# Altium schematic sheet Kivipallur_joonis2.SchDoc
size A4; SheetNumber: 3; SheetTotal: 4
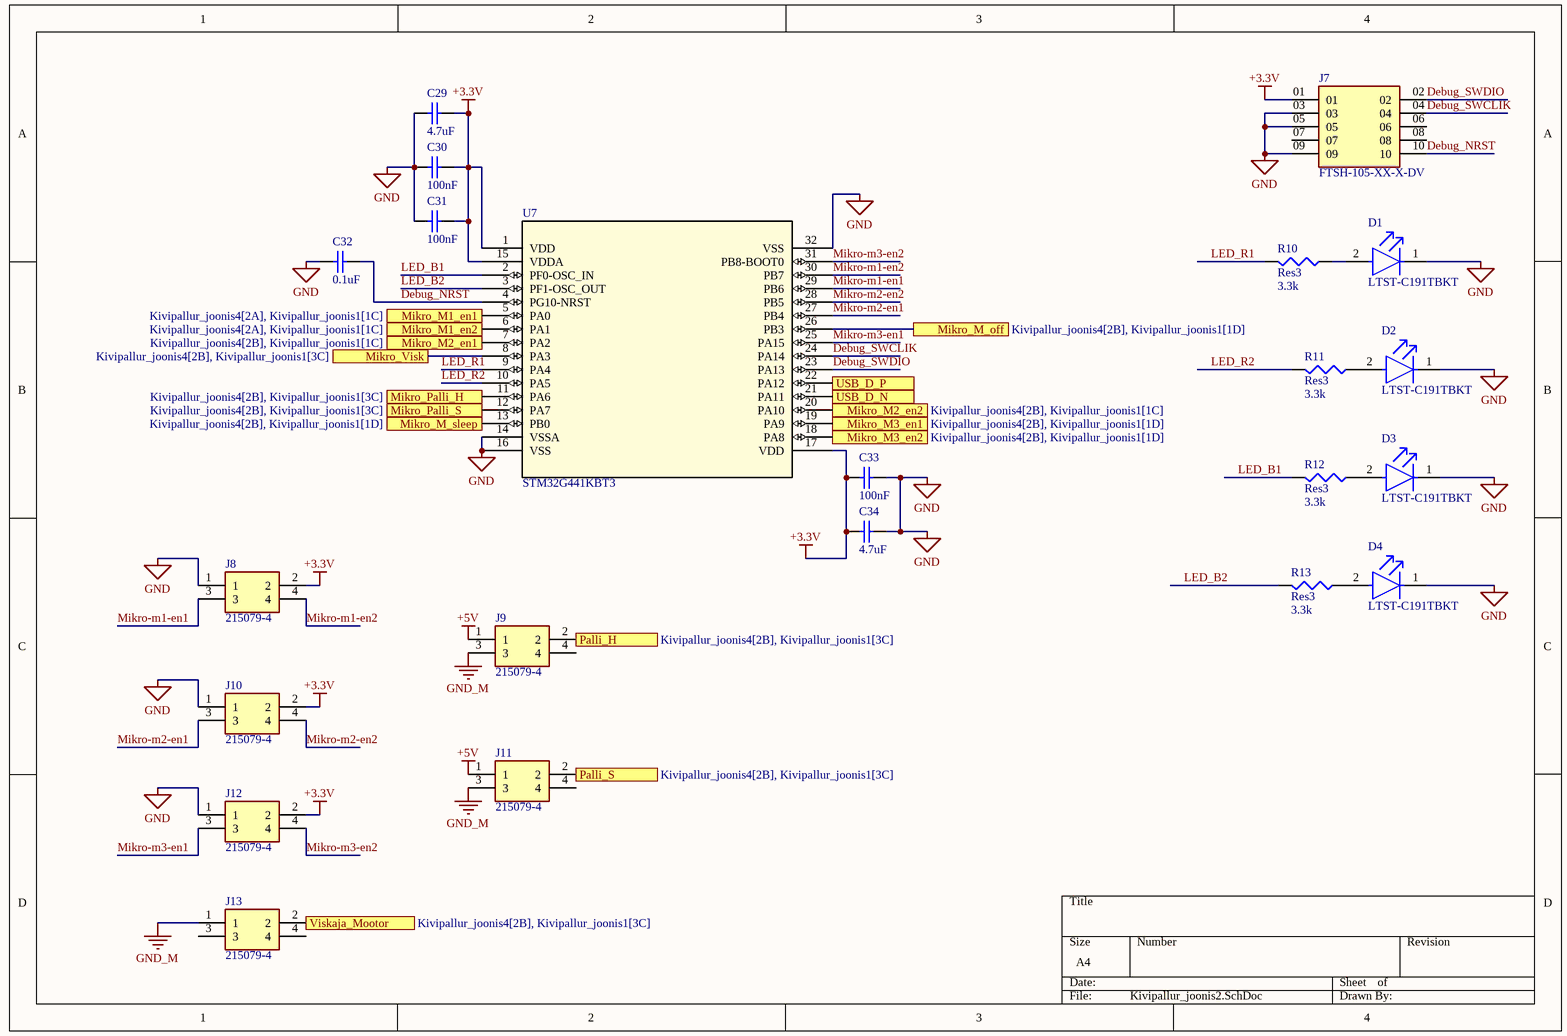
[diagram p0: Kivipallur_joonis2.SchDoc]

## Parts
C29  value 4.7uF  [1608[0603]]  (hidden comment: Cap Semi)
C30  value 100nF  [1608[0603]]  (hidden comment: Cap Semi)
C31  value 100nF  [1608[0603]]  (hidden comment: Cap Semi)
C32  value 0.1uF  [1608[0603]]  (hidden comment: Cap Semi)
C33  value 100nF  [1608[0603]]  (hidden comment: Cap Semi)
C34  value 4.7uF  [1608[0603]]  (hidden comment: Cap Semi)
D1  LTST-C191TBKT  [FP-LTST-C191TBKT-MFG]
D2  LTST-C191TBKT  [FP-LTST-C191TBKT-MFG]
D3  LTST-C191TBKT  [FP-LTST-C191TBKT-MFG]
D4  LTST-C191TBKT  [FP-LTST-C191TBKT-MFG]
J7  FTSH-105-XX-X-DV  [SAMTEC_FTSH-105-XX-X-DV]
J8  215079-4  [TE_215079-4]
J9  215079-4  [TE_215079-4]
J10  215079-4  [TE_215079-4]
J11  215079-4  [TE_215079-4]
J12  215079-4  [TE_215079-4]
J13  215079-4  [TE_215079-4]
R10  Res3  value 3.3k  [J1-0603]
R11  Res3  value 3.3k  [J1-0603]
R12  Res3  value 3.3k  [J1-0603]
R13  Res3  value 3.3k  [J1-0603]
U7  STM32G441KBT3  [LQFP32_7X7_STM]

## Ports
Mikro_M1_en1 (see Kivipallur_joonis4[2A], Kivipallur_joonis1[1C]), Mikro_M1_en2 (see Kivipallur_joonis4[2A], Kivipallur_joonis1[1C]), Mikro_M2_en1 (see Kivipallur_joonis4[2B], Kivipallur_joonis1[1C]), Mikro_M2_en2 (see Kivipallur_joonis4[2B], Kivipallur_joonis1[1C]), Mikro_M3_en1 (see Kivipallur_joonis4[2B], Kivipallur_joonis1[1D]), Mikro_M3_en2 (see Kivipallur_joonis4[2B], Kivipallur_joonis1[1D]), Mikro_M_off (see Kivipallur_joonis4[2B], Kivipallur_joonis1[1D]), Mikro_M_sleep (see Kivipallur_joonis4[2B], Kivipallur_joonis1[1D]), Mikro_Palli_H (see Kivipallur_joonis4[2B], Kivipallur_joonis1[3C]), Mikro_Palli_S (see Kivipallur_joonis4[2B], Kivipallur_joonis1[3C]), Mikro_Visk (see Kivipallur_joonis4[2B], Kivipallur_joonis1[3C]), Palli_H (see Kivipallur_joonis4[2B], Kivipallur_joonis1[3C]), Palli_S (see Kivipallur_joonis4[2B], Kivipallur_joonis1[3C]), USB_D_N, USB_D_P, Viskaja_Mootor (see Kivipallur_joonis4[2B], Kivipallur_joonis1[3C])

## Nets
+3.3V: C29.2 C30.2 C31.2 C33.1 C34.1 J7.01 J8.2 J10.2 J12.2 U7.1(VDD) U7.15(VDDA) U7.17(VDD)
+5V: J9.1 J11.1
GND: C29.1 C30.1 C31.1 C32.1 C33.2 C34.2 D1.1(C) D2.1(C) D3.1(C) D4.1(C) J7.03 J7.05 J7.09 J8.1 J10.1 J12.1 U7.14(VSSA) U7.16(VSS) U7.32(VSS)
GND_M: J9.3 J11.3 J13.1
Debug_NRST: C32.2 J7.10 U7.4(PG10-NRST)
Debug_SWCLIK: J7.04 U7.24(PA14)
Debug_SWDIO: J7.02 U7.23(PA13)
LED_B1: R12.2 U7.2(PF0-OSC_IN)
LED_B2: R13.2 U7.3(PF1-OSC_OUT)
LED_R1: R10.2 U7.9(PA4)
LED_R2: R11.2 U7.10(PA5)
Mikro-m1-en1: J8.3 U7.29(PB6)
Mikro-m1-en2: J8.4 U7.30(PB7)
Mikro-m2-en1: J10.3 U7.27(PB4)
Mikro-m2-en2: J10.4 U7.28(PB5)
Mikro-m3-en1: J12.3 U7.25(PA15)
Mikro-m3-en2: J12.4 U7.31(PB8-BOOT0)
Mikro_M1_en1: U7.5(PA0) ; port Mikro_M1_en1
Mikro_M1_en2: U7.6(PA1) ; port Mikro_M1_en2
Mikro_M2_en1: U7.7(PA2) ; port Mikro_M2_en1
Mikro_M2_en2: U7.20(PA10) ; port Mikro_M2_en2
Mikro_M3_en1: U7.19(PA9) ; port Mikro_M3_en1
Mikro_M3_en2: U7.18(PA8) ; port Mikro_M3_en2
Mikro_M_off: U7.26(PB3) ; port Mikro_M_off
Mikro_M_sleep: U7.13(PB0) ; port Mikro_M_sleep
Mikro_Palli_H: U7.11(PA6) ; port Mikro_Palli_H
Mikro_Palli_S: U7.12(PA7) ; port Mikro_Palli_S
Mikro_Visk: U7.8(PA3) ; port Mikro_Visk
Palli_H: J9.2 ; port Palli_H
Palli_S: J11.2 ; port Palli_S
USB_D_N: U7.21(PA11) ; port USB_D_N
USB_D_P: U7.22(PA12) ; port USB_D_P
Viskaja_Mootor: J13.2 ; port Viskaja_Mootor
NetD1_2: D1.2(A) R10.1
NetD2_2: D2.2(A) R11.1
NetD3_2: D3.2(A) R12.1
NetD4_2: D4.2(A) R13.1

Not connected (* = marked no-connect by the designer): J7 06 07 08; J9 4; J11 4; J13 3 4

## Library data of the parts
C29-C34 = Cap Semi: Capacitor (Semiconductor SIM Model); Published: 8-Jun-2000; PackageReference: C1206; Publisher: Altium Limited; PackageDescription: Chip Capacitor; LatestRevisionDate: 29-May-2009; LatestRevisionNote: IPC-7351 Footprint Added.
D1-D4 = CMP-22017-000008-1: LED BLUE CLEAR CHIP SMD; Lens Color: Colorless; Dominant Wavelength: 475nm; Forward Current: 20mA; Wavelength: 468nm; Viewing Angle: 130°; Power Dissipation: 76mW; Luminous Intensity: 180mcd; Reverse Voltage: 5V; Number of Elements: 1; Lens Style: Diffused; Forward Voltage: 3.8V; Max Power Dissipation: 75mW; Case Code (Metric): 1608; Packaging: Tape and Reel; Case/Package: 0603; Depth: 1.6mm; Mount: Surface Mount; Lead Free: Lead Free; Min Operating Temperature: -20°C; Lens Transparency: Clear; Illumination Color: Blue; Height: 0.55mm; Test Current: 20mA; Case Code (Imperial): 0603; Max Operating Temperature: 80°C; Number of Pins: 2; Length: 0.8mm; Radiation Hardening: No; Package Quantity: 1; Number of LEDs: 1; Width: 0.8mm; Color: Blue
J7 = FTSH-105-XX-X-DV: Connector Header Surface Mount 10 position 0.050" (1.27mm); Availability: Unavailable; Package: None; MP: FTSH-105-XX-X-DV; Price: None; Value: *
J8-J13 = 215079-4: 4 Position Receptacle Connector Through Hole; MF: TE Connectivity; Price: None; Availability: Unavailable; SnapEDA_Link: https://www.snapeda.com/parts/215079-4/TE%20Connectivity%20AMP%20Connectors/view-part/2366486/?ref=snap; EU_RoHS_Compliance: Compliant; Value: *; MP: 215079-4; TE_purchase_URL: https://www.te.com/usa-en/product-215079-4.html?te_bu=Cor&te_type=disp&te_campaign=seda_glo_cor-seda-global-disp-prtnr-fy19-seda-model-bom-cta_sma-317_1&elqCampaignId=32493; Package: SMD-6 Omron Electronics
R10-R13 = Res3: Resistor; Published: 8-Jun-2000; LatestRevisionDate: 29-May-2009; LatestRevisionNote: IPC-7351 Footprint Added.; PackageReference: J1-0603; Publisher: Altium Limited; PackageDescription: Chip Resistor
U7 = STM32G441KBT3: No Description Available; Mfr_Name: STMicroelectronics; Copyright: Copyright (C) 2022 Ultra Librarian. All rights reserved.; Manufacturer_Part_Number: STM32G441KBT3; RefDes: RefDes; Type: DEV